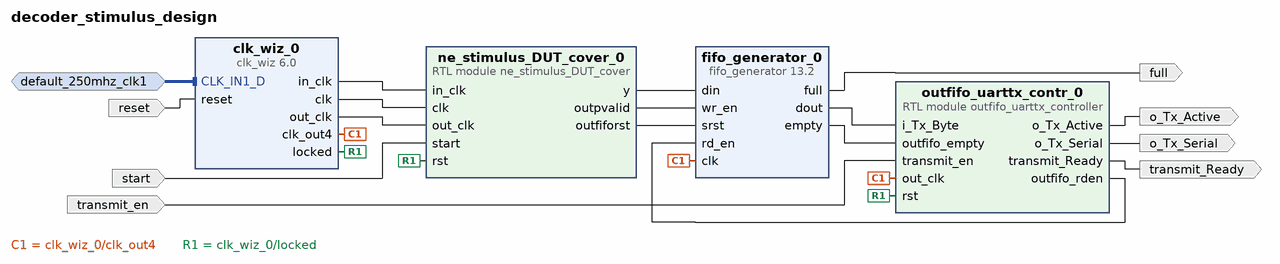
[diagram p0: block diagram of the top level]
# Vivado block design decoder_stimulus_design, xcvu9p-flga2104-2L-e, Vivado 2019.1
create_bd_design decoder_stimulus_design

create_bd_intf_port -mode Slave -vlnv xilinx.com:interface:diff_clock_rtl:1.0 default_250mhz_clk1
set_property -dict {CONFIG.FREQ_HZ 250000000} [get_bd_intf_ports default_250mhz_clk1]
create_bd_port -dir I -type rst reset
set_property -dict {CONFIG.POLARITY ACTIVE_HIGH} [get_bd_ports reset]
create_bd_port -dir I start
create_bd_port -dir O o_Tx_Active
create_bd_port -dir O o_Tx_Serial
create_bd_port -dir O transmit_Ready
create_bd_port -dir O full
create_bd_port -dir I transmit_en

create_bd_cell -type module -reference outfifo_uarttx_controller outfifo_uarttx_contr_0
create_bd_cell -type ip -vlnv xilinx.com:ip:fifo_generator:13.2 fifo_generator_0
set_property -dict [list \
  CONFIG.Input_Data_Width 32 \
  CONFIG.Output_Data_Width 8 \
  CONFIG.asymmetric_port_width true \
] [get_bd_cells fifo_generator_0]
create_bd_cell -type ip -vlnv xilinx.com:ip:clk_wiz:6.0 clk_wiz_0
set_property -dict [list \
  CONFIG.CLKIN1_JITTER_PS 40.0 \
  CONFIG.CLKOUT1_JITTER 157.586 \
  CONFIG.CLKOUT1_PHASE_ERROR 253.053 \
  CONFIG.CLKOUT1_REQUESTED_OUT_FREQ 44.680756 \
  CONFIG.CLKOUT2_JITTER 124.834 \
  CONFIG.CLKOUT2_PHASE_ERROR 253.053 \
  CONFIG.CLKOUT2_REQUESTED_OUT_FREQ 250 \
  CONFIG.CLKOUT2_USED true \
  CONFIG.CLKOUT3_JITTER 160.906 \
  CONFIG.CLKOUT3_PHASE_ERROR 253.053 \
  CONFIG.CLKOUT3_REQUESTED_OUT_FREQ 38.876878059 \
  CONFIG.CLKOUT3_USED true \
  CONFIG.CLKOUT4_JITTER 124.834 \
  CONFIG.CLKOUT4_PHASE_ERROR 253.053 \
  CONFIG.CLKOUT4_REQUESTED_OUT_FREQ 250 \
  CONFIG.CLKOUT4_USED true \
  CONFIG.CLK_IN1_BOARD_INTERFACE default_250mhz_clk1 \
  CONFIG.CLK_OUT1_PORT in_clk \
  CONFIG.CLK_OUT2_PORT clk \
  CONFIG.CLK_OUT3_PORT out_clk \
  CONFIG.MMCM_CLKFBOUT_MULT_F 78.125 \
  CONFIG.MMCM_CLKIN1_PERIOD 4.000 \
  CONFIG.MMCM_CLKIN2_PERIOD 10.0 \
  CONFIG.MMCM_CLKOUT0_DIVIDE_F 33.625 \
  CONFIG.MMCM_CLKOUT1_DIVIDE 6 \
  CONFIG.MMCM_CLKOUT2_DIVIDE 39 \
  CONFIG.MMCM_CLKOUT3_DIVIDE 6 \
  CONFIG.MMCM_DIVCLK_DIVIDE 13 \
  CONFIG.NUM_OUT_CLKS 4 \
  CONFIG.PRIM_SOURCE Differential_clock_capable_pin \
  CONFIG.RESET_BOARD_INTERFACE reset \
  CONFIG.USE_BOARD_FLOW true \
] [get_bd_cells clk_wiz_0]
create_bd_cell -type module -reference ne_stimulus_DUT_cover ne_stimulus_DUT_cover_0

# ---- connections ----

connect_bd_intf_net -intf_net default_250mhz_clk1_1 [get_bd_intf_ports default_250mhz_clk1] [get_bd_intf_pins clk_wiz_0/CLK_IN1_D]
connect_bd_net [get_bd_ports reset] [get_bd_pins clk_wiz_0/reset]
connect_bd_net [get_bd_pins clk_wiz_0/in_clk] [get_bd_pins ne_stimulus_DUT_cover_0/in_clk]
connect_bd_net [get_bd_pins clk_wiz_0/clk] [get_bd_pins ne_stimulus_DUT_cover_0/clk]
connect_bd_net [get_bd_pins clk_wiz_0/out_clk] [get_bd_pins ne_stimulus_DUT_cover_0/out_clk]
connect_bd_net [get_bd_pins clk_wiz_0/clk_out4] [get_bd_pins outfifo_uarttx_contr_0/out_clk] [get_bd_pins fifo_generator_0/clk]
connect_bd_net [get_bd_pins ne_stimulus_DUT_cover_0/y] [get_bd_pins fifo_generator_0/din]
connect_bd_net [get_bd_pins ne_stimulus_DUT_cover_0/outpvalid] [get_bd_pins fifo_generator_0/wr_en]
connect_bd_net [get_bd_pins fifo_generator_0/dout] [get_bd_pins outfifo_uarttx_contr_0/i_Tx_Byte]
connect_bd_net [get_bd_pins fifo_generator_0/empty] [get_bd_pins outfifo_uarttx_contr_0/outfifo_empty]
connect_bd_net [get_bd_pins outfifo_uarttx_contr_0/outfifo_rden] [get_bd_pins fifo_generator_0/rd_en]
connect_bd_net [get_bd_pins clk_wiz_0/locked] [get_bd_pins outfifo_uarttx_contr_0/rst] [get_bd_pins ne_stimulus_DUT_cover_0/rst]
connect_bd_net [get_bd_pins ne_stimulus_DUT_cover_0/outfiforst] [get_bd_pins fifo_generator_0/srst]
connect_bd_net [get_bd_ports start] [get_bd_pins ne_stimulus_DUT_cover_0/start]
connect_bd_net [get_bd_pins outfifo_uarttx_contr_0/o_Tx_Active] [get_bd_ports o_Tx_Active]
connect_bd_net [get_bd_pins outfifo_uarttx_contr_0/o_Tx_Serial] [get_bd_ports o_Tx_Serial]
connect_bd_net [get_bd_pins outfifo_uarttx_contr_0/transmit_Ready] [get_bd_ports transmit_Ready]
connect_bd_net [get_bd_pins fifo_generator_0/full] [get_bd_ports full]
connect_bd_net [get_bd_ports transmit_en] [get_bd_pins outfifo_uarttx_contr_0/transmit_en]

validate_bd_design
save_bd_design
